# EAGLE schematic EEGAmp_Thruhole (EAGLE 9.6.2)
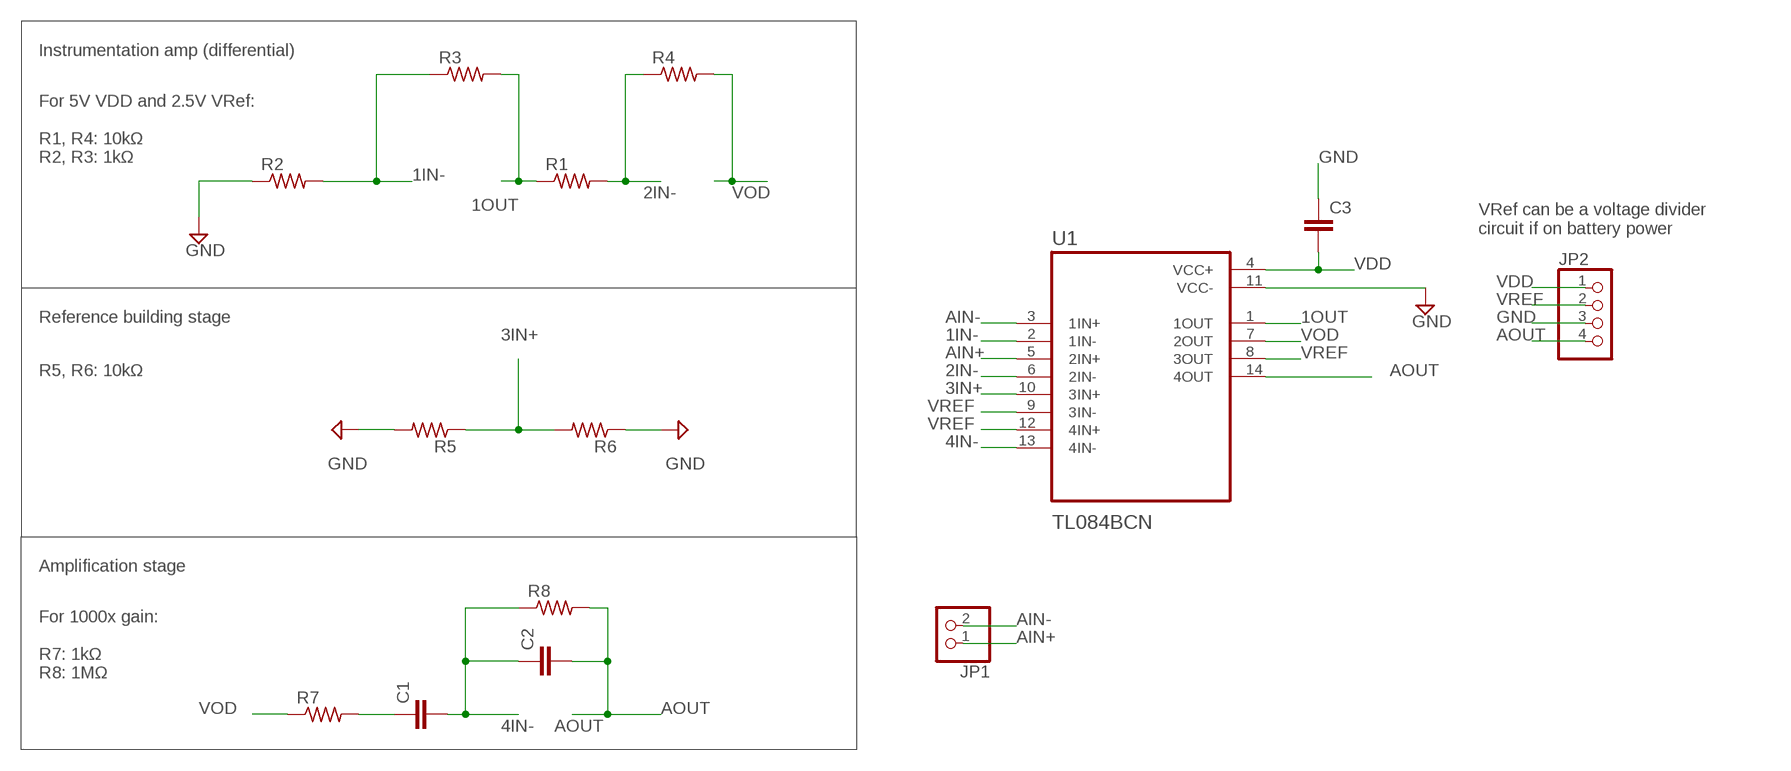
[diagram p0: schematic, sheet 1]

## Parts
C1  C2.5/2  [C2.5-2]
C2  C2.5/2  [C2.5-2]
C3  C2.5/2  [C2.5-2]
JP1  PINHD-1X2  [1X02]
JP2  PINHD-1X4  [1X04]
R1  R-US_0204/5  [0204/5]
R2  R-US_0204/5  [0204/5]
R3  R-US_0204/5  [0204/5]
R4  R-US_0204/5  [0204/5]
R5  R-US_0204/5  [0204/5]
R6  R-US_0204/5  [0204/5]
R7  R-US_0204/5  [0204/5]
R8  R-US_0204/5  [0204/5]
U1  TL084BCN  [DIP794W45P254L1969H508Q14]

## Nets
1IN-: R2.2 R3.1 U1.2(1IN-)
1OUT: R1.1 R3.2 U1.1(1OUT)
2IN-: R1.2 R4.1 U1.6(2IN-)
3IN+: R5.1 R6.2 U1.10(3IN+)
4IN-: C1.2 C2.1 R8.1 U1.13(4IN-)
AIN+: JP1.1 U1.5(2IN+)
AIN-: JP1.2 U1.3(1IN+)
AOUT: C2.2 JP2.4 R8.2 U1.14(4OUT)
GND: C3.1 JP2.3 R2.1 R5.2 R6.1 U1.11(VCC-)
N$9: C1.1 R7.2
VDD: C3.2 JP2.1 U1.4(VCC+)
VOD: R4.2 R7.1 U1.7(2OUT)
VREF: JP2.2 U1.8(3OUT) U1.9(3IN-) U1.12(4IN+)

## Notes on the sheet
- Instrumentation amp (differential)
- For 5V VDD and 2.5V VRef:
  
  R1, R4: 10kΩ
  R2, R3: 1kΩ
- VRef can be a voltage divider 
  circuit if on battery power
- Reference building stage
- R5, R6: 10kΩ
- Amplification stage
- For 1000x gain:
  
  R7: 1kΩ
  R8: 1MΩ

## Library data of the parts
C1-C3 = capacitor-wima:C: CAPACITOR naming: grid - package width
JP1 = pinhead:PINHD-1X2: PIN HEADER
JP2 = pinhead:PINHD-1X4: PIN HEADER
R1-R8 = rcl:R-US_: RESISTOR, American symbol; SPICEPREFIX: R
U1 = TL084BCN:TL084BCN: Check availability <https://pricing.snapeda.com/parts/TL084BCN/Texas%20Instruments/view-part?ref=eda>; AVAILABILITY: In Stock; CHECK_PRICES: https://www.snapeda.com/parts/TL084BCN/Texas+Instruments/view-part/?ref=eda; DESCRIPTION: Quad, 30-V, 3-MHz, 13-V/µs slew rate, 3-mV offset voltage, In to V+, JFET-input op amp; MF: Texas Instruments; MP: TL084BCN; PACKAGE: PDIP-14 Texas Instruments; PRICE: None; PURCHASE-URL: https://www.snapeda.com/api/url_track_click_mouser/?unipart_id=565503&manufacturer=Texas Instruments&part_name=TL084BCN&search_term=tl084; SNAPEDA_LINK: https://www.snapeda.com/parts/TL084BCN/Texas+Instruments/view-part/?ref=snap